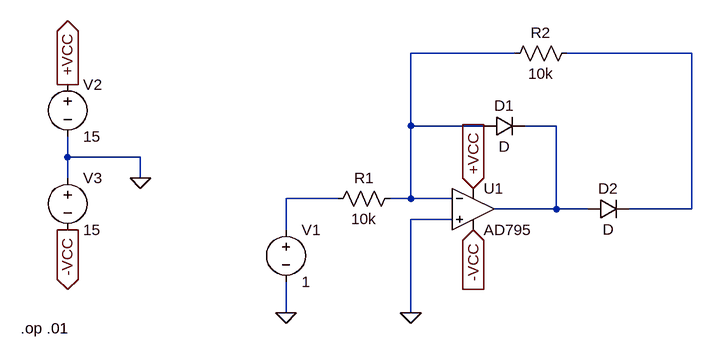
[diagram p0: schematic PROVA - Questao_03_P1_2019.asc]
PROVA - Questao_03_P1_2019.asc, the LTspice schematic file:
Version 4
SHEET 1 880 680
WIRE 288 -80 128 -80
WIRE 560 -80 368 -80
WIRE 128 32 128 -80
WIRE 240 32 128 32
WIRE 352 32 304 32
WIRE -400 80 -400 48
WIRE -288 80 -400 80
WIRE -400 112 -400 80
WIRE -288 112 -288 80
WIRE 16 144 -64 144
WIRE 128 144 128 32
WIRE 128 144 96 144
WIRE 192 144 128 144
WIRE 352 160 352 32
WIRE 352 160 256 160
WIRE 400 160 352 160
WIRE 560 160 560 -80
WIRE 560 160 464 160
WIRE 192 176 128 176
WIRE -64 192 -64 144
WIRE -64 320 -64 272
WIRE 128 320 128 176
FLAG 128 320 0
FLAG -64 320 0
FLAG -288 112 0
FLAG -400 -32 +VCC
IOPIN -400 -32 Out
FLAG -400 192 -VCC
IOPIN -400 192 Out
FLAG 224 192 -VCC
IOPIN 224 192 In
FLAG 224 128 +VCC
IOPIN 224 128 In
SYMBOL voltage -64 176 R0
WINDOW 123 0 0 Left 2
WINDOW 39 0 0 Left 2
SYMATTR InstName V1
SYMATTR Value 1
SYMBOL res 0 160 R270
WINDOW 0 32 56 VTop 2
WINDOW 3 0 56 VBottom 2
SYMATTR InstName R1
SYMATTR Value 10k
SYMBOL res 272 -64 R270
WINDOW 0 32 56 VTop 2
WINDOW 3 0 56 VBottom 2
SYMATTR InstName R2
SYMATTR Value 10k
SYMBOL diode 240 48 R270
WINDOW 0 32 32 VTop 2
WINDOW 3 0 32 VBottom 2
SYMATTR InstName D1
SYMBOL diode 400 176 R270
WINDOW 0 32 32 VTop 2
WINDOW 3 0 32 VBottom 2
SYMATTR InstName D2
SYMBOL Opamps\\AD795 224 96 R0
SYMATTR InstName U1
SYMBOL voltage -400 -48 R0
WINDOW 123 0 0 Left 2
WINDOW 39 0 0 Left 2
SYMATTR InstName V2
SYMATTR Value 15
SYMBOL voltage -400 96 R0
WINDOW 123 0 0 Left 2
WINDOW 39 0 0 Left 2
SYMATTR InstName V3
SYMATTR Value 15
TEXT -472 344 Left 2 !.op .01

The netlist it stands for:
* PROVA - Questao_03_P1_2019.asc
V1 N004 0 1
R1 N004 N001 10k
R2 N001 N002 10k
D1 N001 N003 D
D2 N003 N002 D
XU1 0 N001 +VCC -VCC N003 AD795  ; pins In+ In- V+ V- OUT
V2 +VCC 0 15
V3 0 -VCC 15
.model D D
.lib standard.dio
.op .01
.lib ADI1.lib
.backanno
.end